# EAGLE design mk2 (EAGLE 7.2.0)
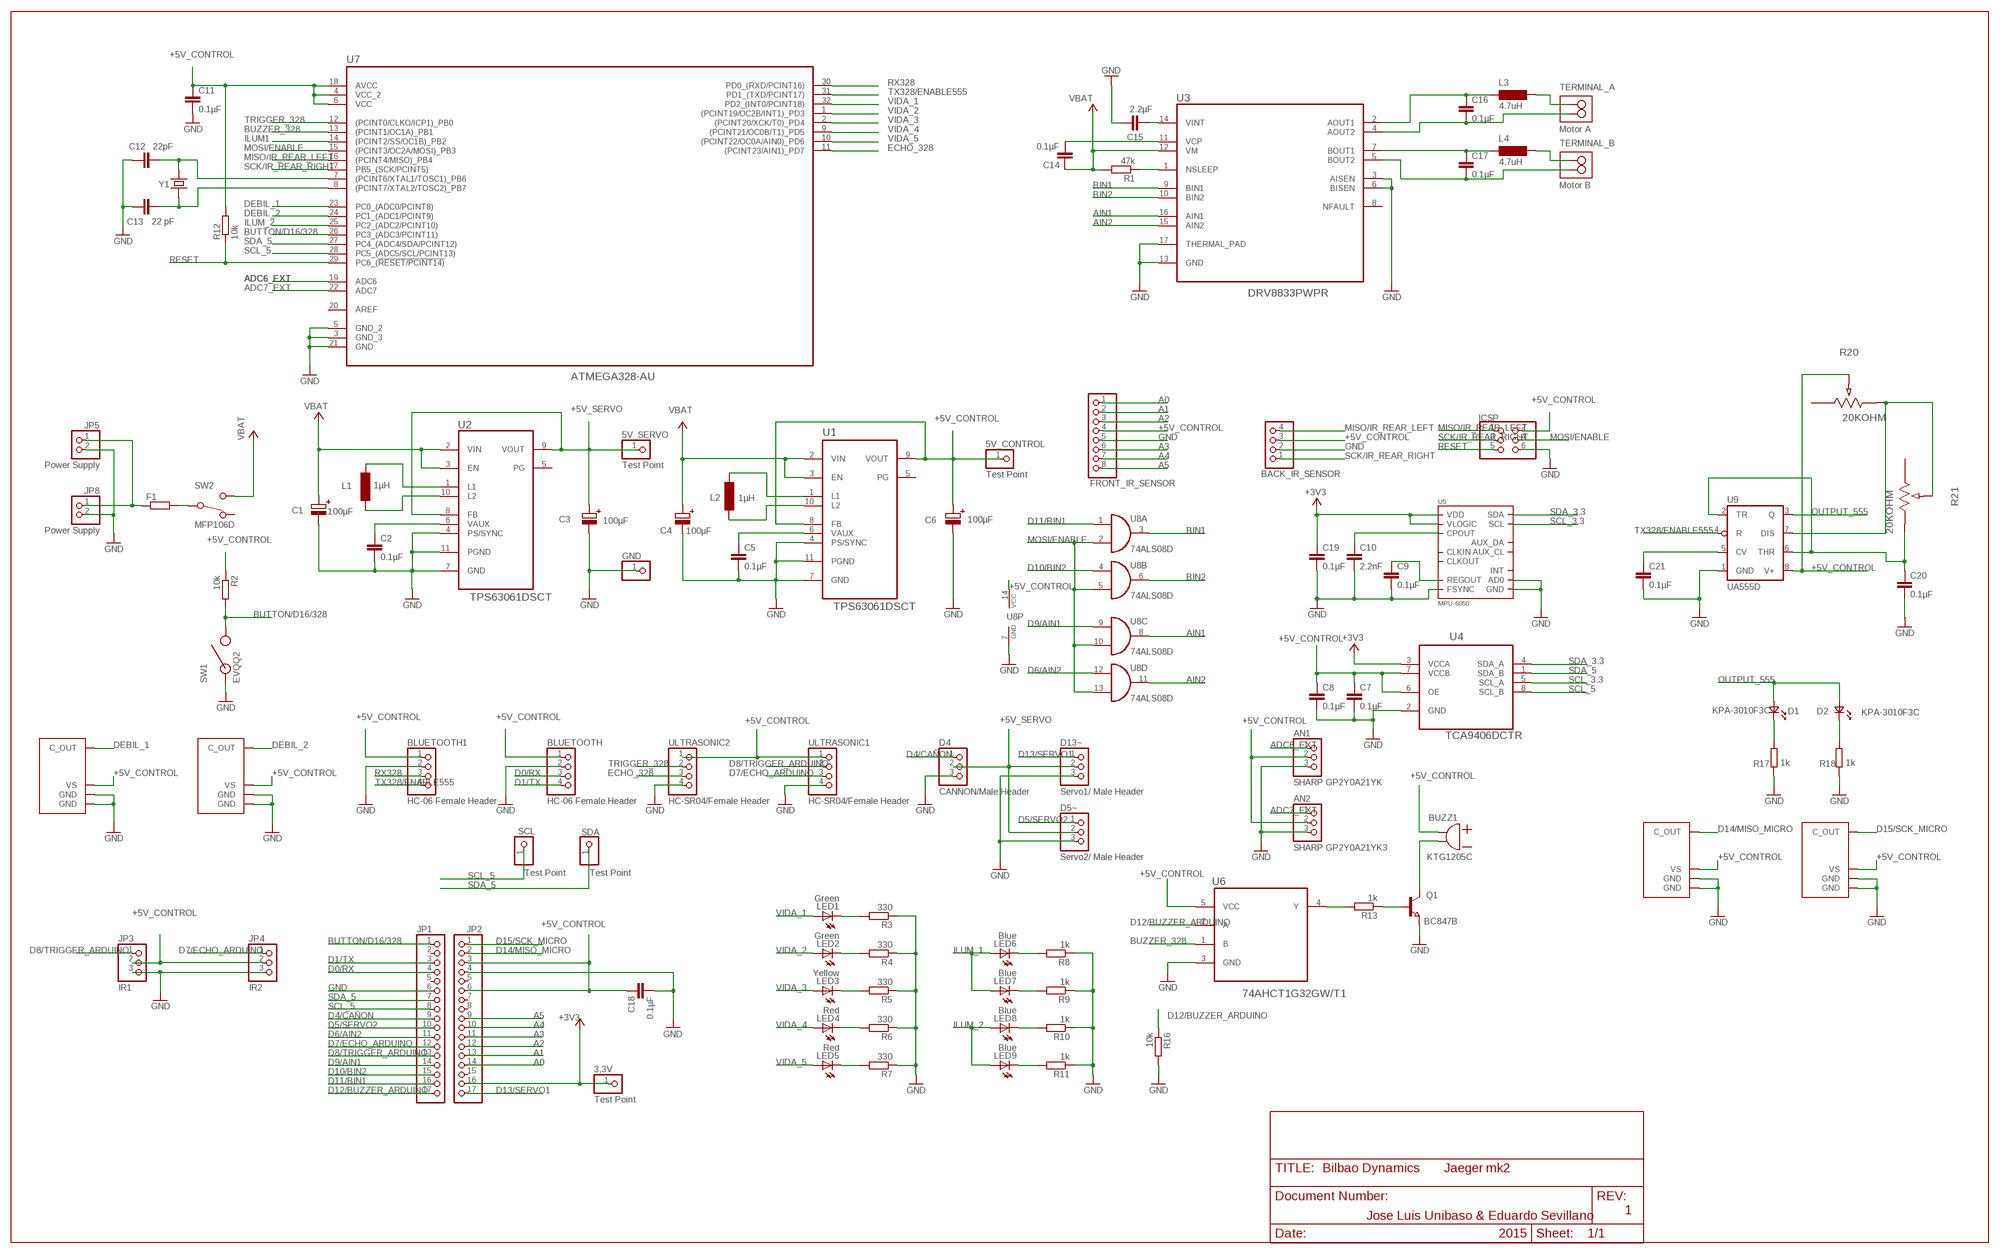
[diagram p0: schematic, sheet 1]

## Parts
3,3V  Test Point  PINHD-1X1  [1X01]
5V_CONTROL  Test Point  PINHD-1X1  [1X01]
5V_SERVO  Test Point  PINHD-1X1  [1X01]
AN1  SHARP GP2Y0A21YK  PINHD-1X3  [1X03]
AN2  SHARP GP2Y0A21YK3  PINHD-1X3  [1X03]
BACK_IR_SENSOR  PINHD-1X4  [1X04]
BLUETOOTH  HC-06 Female Header  PINHD-1X4  [1X04]
BLUETOOTH1  HC-06 Female Header  PINHD-1X4  [1X04]
BUZZ1  KTG1205C  [KTG1205C]
C1  100µF  EDK107M016A9G  [EDK107M016A9G]
C2  0.1µF  C-EUC0805K  [C0805K]
C3  100µF  EDK107M016A9G  [EDK107M016A9G]
C4  100µF  EDK107M016A9G  [EDK107M016A9G]
C5  0.1µF  C-EUC0805K  [C0805K]
C6  100µF  EDK107M016A9G  [EDK107M016A9G]
C7  0.1µF  C-EUC0805  [C0805]
C8  0.1µF  C-EUC0805  [C0805]
C9  0.1µF  C-EUC0805  [C0805]
C10  2.2nF  C-EUC0805  [C0805]
C11  0.1µF  C-EUC0805K  [C0805K]
C12  22pF  C-EUC0805K  [C0805K]
C13  22 pF  C-EUC0805K  [C0805K]
C14  0.1µF  C-EUC0805  [C0805]
C15  2.2µF  C-EUC0805  [C0805]
C16  0.1µF  C-EUC0805  [C0805]
C17  0.1µF  C-EUC0805  [C0805]
C18  0.1µF  C-EUC0805  [C0805]
C19  0.1µF  C-EUC0805  [C0805]
C20  0.1µF  C-EUC0805  [C0805]
C21  0.1µF  C-EUC0805  [C0805]
D1  KPA-3010F3C  [KPA-3010F3C]
D2  KPA-3010F3C  [KPA-3010F3C]
D4  CANNON/Male Header  PINHD-1X3  [1X03]
D5~  Servo2/ Male Header  PINHD-1X3  [1X03]
D13~  Servo1/ Male Header  PINHD-1X3  [1X03]
F1  R-EU_R1206  [R1206]
FRONT_IR_SENSOR  PINHD-1X8  [1X08]
GND  PINHD-1X1  [1X01]
ICSP  PINHD-2X3  [2X03]
IR_REC1  TSMP77000TR  [TSMP77000TR]
IR_REC2  TSMP77000TR  [TSMP77000TR]
IR_REC3  TSMP77000TR  [TSMP77000TR]
IR_REC4  TSMP77000TR  [TSMP77000TR]
JP1  PINHD-1X17  [1X17]
JP2  PINHD-1X17  [1X17]
JP3  IR1  PINHD-1X3  [1X03]
JP4  IR2  PINHD-1X3  [1X03]
JP5  Power Supply  PINHD-1X2  [1X02]
JP8  Power Supply  PINHD-1X2  [1X02]
L1  1µH  MCSDRH73B  [MCSDRH73B]
L2  1µH  MCSDRH73B  [MCSDRH73B]
L3  4.7uH  SRN4012T-4R7M  [SRN4012T-4R7M]
L4  4.7uH  SRN4012T-4R7M  [SRN4012T-4R7M]
LED1  Green  LEDSML0805  [SML0805]
LED2  Green  LEDSML0805  [SML0805]
LED3  Yellow  LEDSML0805  [SML0805]
LED4  Red  LEDSML0805  [SML0805]
LED5  Red  LEDSML0805  [SML0805]
LED6  Blue  LEDSML0805  [SML0805]
LED7  Blue  LEDSML0805  [SML0805]
LED8  Blue  LEDSML0805  [SML0805]
LED9  Blue  LEDSML0805  [SML0805]
Q1  BC847B  NPN-TRANSISTOR_SOT23  [SOT23]
R1  47k  R-EU_R0805  [R0805]
R2  10k  R-EU_R0805  [R0805]
R3  330  R-EU_R0805  [R0805]
R4  330  R-EU_R0805  [R0805]
R5  330  R-EU_R0805  [R0805]
R6  330  R-EU_R0805  [R0805]
R7  330  R-EU_R0805  [R0805]
R8  1k  R-EU_R0805  [R0805]
R9  1k  R-EU_R0805  [R0805]
R10  1k  R-EU_R0805  [R0805]
R11  1k  R-EU_R0805  [R0805]
R12  10k  R-EU_R0805  [R0805]
R13  1k  R-EU_R0805  [R0805]
R16  10k  R-EU_R0805  [R0805]
R17  1k  R-EU_R0805  [R0805]
R18  1k  R-EU_R0805  [R0805]
R20  20KOHM  EVM2NSX80B24-2N  [POT_EVM2N]
R21  20KOHM  EVM2NSX80B24-2N  [POT_EVM2N]
SCL  Test Point  PINHD-1X1  [1X01]
SDA  Test Point  PINHD-1X1  [1X01]
SW1  EVQQ2  [EVQQ2]
SW2  MFP106D  [MFP106D]
TERMINAL_A  Motor A  CTB30512BK  [CTB30512BK]
TERMINAL_B  Motor B  CTB30512BK  [CTB30512BK]
U1  TPS63061DSCT  [SON50P300X300X80-11N]
U2  TPS63061DSCT  [SON50P300X300X80-11N]
U3  DRV8833PWPR  [SOP65P640X120-17N]
U4  TCA9406DCTR  [SOP65P400X130-8N]
U5  MPU-6050  [QFN.24.4X4]
U6  74AHCT1G32GW/T1  [SOT65P210X110-5N]
U7  ATMEGA328-AU  [QFP80P900X900X120-32N]
U8  74ALS08D  [SO14]
U9  UA555D  [SO08]
ULTRASONIC1  HC-SR04/Female Header  PINHD-1X4  [1X04]
ULTRASONIC2  HC-SR04/Female Header  PINHD-1X4  [1X04]
Y1  E3SB16.0000F09G11AE  [E3SB16.0000F09G11A]

## Nets
+3V3: 3,3V.1 JP2.16 U4.3(VCCA)
+5V_CONTROL: 5V_CONTROL.1 AN1.2 AN2.2 BACK_IR_SENSOR.3 BLUETOOTH1.1 BLUETOOTH.1 BUZZ1.+ C6.1 C7.1 C8.1 C11.1 C18.1 FRONT_IR_SENSOR.4 ICSP.2 IR_REC1.2(VS) IR_REC2.2(VS) IR_REC3.2(VS) IR_REC4.2(VS) JP2.3 JP2.6 JP3.2 JP4.2 R2.1 R12.2 R20.2 U1.8(FB) U1.9(VOUT) U4.6(OE) U4.7(VCCB) U6.5(VCC) U7.4(VCC_2) U7.6(VCC) U7.18(AVCC) U8.14(P:VCC) U9.8(V+) ULTRASONIC1.1 ULTRASONIC2.1
+5V_SERVO: 5V_SERVO.1 C3.1 D4.2 D5~.2 D13~.2 U2.8(FB) U2.9(VOUT)
A0: FRONT_IR_SENSOR.1 JP2.14
A1: FRONT_IR_SENSOR.2 JP2.13
A2: FRONT_IR_SENSOR.3 JP2.12
A3: FRONT_IR_SENSOR.6 JP2.11
A4: FRONT_IR_SENSOR.7 JP2.10
A5: FRONT_IR_SENSOR.8 JP2.9
ADC6_EXT: AN1.1 U7.19(ADC6)
ADC7_EXT: AN2.1 U7.22(ADC7)
AIN1: U3.16(AIN1) U8.8(C:O)
AIN2: U3.15(AIN2) U8.11(D:O)
AM1: L3.P$2 TERMINAL_A.1
BIN1: U3.9(BIN1) U8.3(A:O)
BIN2: U3.10(BIN2) U8.6(B:O)
BM1: L4.P$2 TERMINAL_B.1
BUTTON/D16/328: JP1.1 R2.2 SW1.P$1 SW1.P$4 U7.26(PC3_(ADC3/PCINT11))
BUZZER_328: U6.1(B) U7.13((PCINT1/OC1A)_PB1)
C14: C13.2 U7.8((PCINT7/XTAL2/TOSC2)_PB7) Y1.1
D0/RX: BLUETOOTH.3 JP1.4
D1/TX: BLUETOOTH.4 JP1.3
D2: D2.C R18.1
D4/CAÑON: D4.1 JP1.9
D5/SERVO2: D5~.1 JP1.10
D6/AIN2: JP1.11 U8.12(D:I0)
D7/ECHO_ARDUINO: JP1.12 JP4.1 ULTRASONIC1.3
D8/TRIGGER_ARDUINO: JP1.13 JP3.1 ULTRASONIC1.2
D9/AIN1: JP1.14 U8.9(C:I0)
D10/BIN2: JP1.15 U8.4(B:I0)
D11/BIN1: JP1.16 U8.1(A:I0)
D12/BUZZER_ARDUINO: JP1.17 R16.1 U6.2(A)
D13/SERVO1: D13~.1 JP2.17
D14/MISO_MICRO: IR_REC1.3(C_OUT) JP2.2
D15/SCK_MICRO: IR_REC2.3(C_OUT) JP2.1
DEBIL_1: IR_REC3.3(C_OUT) U7.23(PC0_(ADC0/PCINT8))
DEBIL_2: IR_REC4.3(C_OUT) U7.24(PC1_(ADC1/PCINT9))
ECHO_328: U7.11((PCINT23/AIN1)_PD7) ULTRASONIC2.3
GND: AN1.3 AN2.3 BACK_IR_SENSOR.2 BLUETOOTH1.2 BLUETOOTH.2 C1.2 C2.2 C3.2 C4.2 C5.2 C6.2 C7.2 C8.2 C9.2 C10.2 C11.2 C12.1 C13.1 C15.1 C18.2 C19.2 C20.2 C21.2 D4.3 D5~.3 D13~.3 FRONT_IR_SENSOR.5 GND.1 ICSP.6 IR_REC1.1(GND) IR_REC1.4(GND) IR_REC2.1(GND) IR_REC2.4(GND) IR_REC3.1(GND) IR_REC3.4(GND) IR_REC4.1(GND) IR_REC4.4(GND) JP1.6 JP2.4 JP3.3 JP4.3 JP5.2 JP8.2 Q1.2(E) R3.1 R4.1 R5.1 R6.1 R7.1 R8.1 R9.1 R10.1 R11.1 R16.2 R17.2 R18.2 SW1.P$2 SW1.P$3 U1.4(PS/SYNC) U1.7(GND) U1.11(PGND) U2.4(PS/SYNC) U2.7(GND) U2.11(PGND) U3.3(AISEN) U3.6(BISEN) U3.13(GND) U3.17(THERMAL_PAD) U4.2(GND) U5.9(AD0) U5.11(FSYNC) U5.18(GND) U6.3(GND) U7.3(GND_3) U7.5(GND_2) U7.21(GND) U8.7(P:GND) U9.1(GND) ULTRASONIC1.4 ULTRASONIC2.4
ILUM1: U7.14((PCINT2/SS/OC1B)_PB2)
ILUM_1: LED6.A LED7.A
ILUM_2: LED8.A LED9.A U7.25(PC2_(ADC2/PCINT10))
LED4: LED4.C R6.2
MISO/IR_REAR_LEFT: BACK_IR_SENSOR.4 ICSP.1 U7.16((PCINT4/MISO)_PB4)
MOSI/ENABLE: ICSP.4 U7.15((PCINT3/OC2A/MOSI)_PB3) U8.2(A:I1) U8.5(B:I1) U8.10(C:I1) U8.13(D:I1)
N$1: C16.1 L3.P$1 U3.2(AOUT1)
N$2: C16.2 TERMINAL_A.2 U3.4(AOUT2)
N$3: C17.1 L4.P$1 U3.7(BOUT1)
N$4: C17.2 TERMINAL_B.2 U3.5(BOUT2)
N$5: C19.1 U5.8(VLOGIC) U5.13(VDD)
N$6: F1.1 JP5.1 JP8.1
N$7: R1.1 U3.1(NSLEEP)
N$9: C14.2 U3.11(VCP)
N$10: L2.2 U1.1(L1)
N$11: C2.1 U2.6(VAUX)
N$12: L2.1 U1.10(L2)
N$13: R13.2 U6.4(Y)
N$14: Q1.1(B) R13.1
N$15: L1.2 U2.1(L1)
N$16: L1.1 U2.10(L2)
N$17: BUZZ1.- Q1.3(C)
N$18: C5.1 U1.6(VAUX)
N$19: LED1.C R3.2
N$20: LED2.C R4.2
N$21: LED3.C R5.2
N$22: LED8.C R10.2
N$23: D1.C R17.1
N$24: LED5.C R7.2
N$27: C15.2 U3.14(VINT)
N$28: C12.2 U7.7((PCINT6/XTAL1/TOSC1)_PB6) Y1.2
N$31: C20.1 R21.3 U9.2(TR) U9.6(THR)
N$32: LED6.C R8.2
N$33: LED7.C R9.2
N$34: LED9.C R11.2
N$35: C10.1 U5.20(CPOUT)
N$36: C9.1 U5.10(REGOUT)
N$39: R20.3 R21.2 U9.7(DIS)
N$41: F1.2 SW2.COM
N$42: C21.1 U9.5(CV)
OUTPUT_555: D1.A D2.A U9.3(Q)
RESET: ICSP.5 R12.1 U7.29(PC6_(!RESET/PCINT14))
RX328: BLUETOOTH1.3 U7.30(PD0_(RXD/PCINT16))
SCK/IR_REAR_RIGHT: BACK_IR_SENSOR.1 ICSP.3 U7.17(PB5_(SCK/PCINT5))
SCL_3.3: U4.5(SCL_A) U5.23(SCL)
SCL_5: JP1.8 SCL.1 U4.8(SCL_B) U7.28(PC5_(ADC5/SCL/PCINT13))
SDA_3.3: U4.4(SDA_A) U5.24(SDA)
SDA_5: JP1.7 SDA.1 U4.1(SDA_B) U7.27(PC4_(ADC4/SDA/PCINT12))
TRIGGER_328: U7.12((PCINT0/CLKO/ICP1)_PB0) ULTRASONIC2.2
TX328/ENABLE555: BLUETOOTH1.4 U7.31(PD1_(TXD/PCINT17)) U9.4(R)
VBAT: C1.1 C4.1 C14.1 R1.2 SW2.2 U1.2(VIN) U1.3(EN) U2.2(VIN) U2.3(EN) U3.12(VM)
VIDA_1: LED1.A U7.32(PD2_(INT0/PCINT18))
VIDA_2: LED2.A U7.1((PCINT19/OC2B/INT1)_PD3)
VIDA_3: LED3.A U7.2((PCINT20/XCK/T0)_PD4)
VIDA_4: LED4.A U7.9((PCINT21/OC0B/T1)_PD5)
VIDA_5: LED5.A U7.10((PCINT22/OC0A/AIN0)_PD6)
Unconnected: JP1.2 JP1.5 JP2.5 JP2.7 JP2.8 JP2.15 R20.1 R21.1 SW2.1 U1.5(PG) U2.5(PG) U3.8(NFAULT) U5.1(CLKIN) U5.6(AUX_DA) U5.7(AUX_CL) U5.12(INT) U5.22(CLKOUT) U7.20(AREF)

## Notes on the sheet
- Bilbao Dynamics | Jaeger
- 1
- Jose Luis Unibaso & Eduardo Sevillano
- 2015

## Library data of the parts
3,3V 5V_CONTROL 5V_SERVO GND SCL SDA = pinhead:PINHD-1X1: PIN HEADER
AN1 AN2 D4 D5~ D13~ JP3 JP4 = pinhead:PINHD-1X3: PIN HEADER
BACK_IR_SENSOR BLUETOOTH BLUETOOTH1 ULTRASONIC1 ULTRASONIC2 = pinhead:PINHD-1X4: PIN HEADER
BUZZ1 = Jaegger_MKII:KTG1205C
C1 C3 C4 C6 = Jaegger_MKII:EDK107M016A9G
C2 C5 C7-C21 = rcl:C-EU: CAPACITOR, European symbol
D1 D2 = Jaegger_MKII:KPA-3010F3C
F1 R1-R11 R13 R16-R18 = rcl:R-EU_: RESISTOR, European symbol
FRONT_IR_SENSOR = pinhead:PINHD-1X8: PIN HEADER
ICSP = pinhead:PINHD-2X3: PIN HEADER
IR_REC1-IR_REC4 = Jaegger_MKII:TSMP77000TR
JP1 JP2 = pinhead:PINHD-1X17: PIN HEADER
JP5 JP8 = pinhead:PINHD-1X2: PIN HEADER
L1 L2 = Jaegger_MKII:MCSDRH73B
L3 L4 = Jaegger_MKII:SRN4012T-4R7M
LED1-LED9 = led:LED: LED OSRAM: - CHIPLED LG R971, LG N971, LY N971, LG Q971, LY Q971, LO R971, LY R971 LH N974, LH R974 LS Q976, LO Q976, LY Q976 LO Q996 - Hyper CHIPLED LW Q18S LB Q993, LB Q99A, LB R99A - SideLED LS A670, LO A670, LY A670, LG A670, LP A670 LB A673, LV A673, LT A673, LW A673 LH A674 LY A675 LS A676, LA A676, LO A676, LY A676, LW A676 LS A679, LY A679, LG A679 - Hyper Micro SIDELED® LS Y876, LA Y876, LO Y876, LY Y876 LT Y87S - SmartLED LW L88C, LW L88S LB L89C, LB L89S, LG L890 LS L89K, LO L89K, LY L89K LS L896, LA L896, LO L896, LY L896 - TOPLED LS T670, LO T670, LY T670, LG T670, LP T670 LSG T670, LSP T670, LSY T670, LOP T670, LYG T670 LG T671, LOG T671, LSG T671 LB T673, LV T673, LT T673, LW T673 LH T674 LS T676, LA T676, LO T676, LY T676, LB T676, LH T676, LSB T676, LW T676 LB T67C, LV T67C, LT T67C, LS T67K, LO T67K, LY T67K, LW E67C LS E67B, LA E67B, LO E67B, LY E67B, LB E67C, LV E67C, LT E67C LW T67C LS T679, LY T679, LG T679 LS T770, LO T770, LY T770, LG T770, LP T770 LB T773, LV T773, LT T773, LW T773 LH T774 LS E675, LA E675, LY E675, LS T675 LS T776, LA T776, LO T776, LY T776, LB T776 LHGB T686 LT T68C, LB T68C - Hyper Mini TOPLED® LB M676 - Mini TOPLED Santana® LG M470 LS M47K, LO M47K, LY M47K Source: http://www.osram.convergy.de LUXEON: - LUMILED® LXK2-PW12-R00, LXK2-PW12-S00, LXK2-PW14-U00, LXK2-PW14-V00 LXK2-PM12-R00, LXK2-PM12-S00, LXK2-PM14-U00 LXK2-PE12-Q00, LXK2-PE12-R00, LXK2-PE12-S00, LXK2-PE14-T00, LXK2-PE14-U00 LXK2-PB12-K00, LXK2-PB12-L00, LXK2-PB12-M00, LXK2-PB14-N00, LXK2-PB14-P00, LXK2-PB14-Q00 LXK2-PR12-L00, LXK2-PR12-M00, LXK2-PR14-Q00, LXK2-PR14-R00 LXK2-PD12-Q00, LXK2-PD12-R00, LXK2-PD12-S00 LXK2-PH12-R00, LXK2-PH12-S00 LXK2-PL12-P00, LXK2-PL12-Q00, LXK2-PL12-R00 Source: www.luxeon.com KINGBRIGHT: KA-3528ASYC Source: www.kingbright.com
Q1 = semicon-smd-ipc:NPN-TRANSISTOR_: NPN TRANSISTOR
R12 = resistor:R-EU_: RESISTOR, European symbol
R20 R21 = Panasonic-Trimmer_Potentiometers:EVM: Potentiometers; MPN: EVM2NSX80B24; OC_FARNELL: 1849759; OC_NEWARK: 17T5161; PACKAGE: EVM2N; POWERRATING: 0.15W; SUPPLIER: PANASONIC; TOLERANCE: ±25 %
SW1 = Jaegger_MKII:EVQQ2
SW2 = Jaegger_MKII:MFP106D
TERMINAL_A TERMINAL_B = Jaegger_MKII:CTB30512BK
U1 U2 = Jaegger_MKII:TPS63061DSCT: VOLTAGE BUCK-BOOST CONVERTER,SON- 10; MPN: TPS63061DSCT; OC_FARNELL: 2078527; OC_NEWARK: 82T9734; PACKAGE: SON- 10; SUPPLIER: TEXAS INSTRUMENTS
U3 = Jaegger_MKII:DRV8833PWPR: DUAL H-BRIDGE MOTOR DRIVER,HTSSOP -16; MPN: DRV8833PWPR; OC_FARNELL: 2057085; OC_NEWARK: 64T2941; PACKAGE: HTSSOP -16; SUPPLIER: TEXAS INSTRUMENTS
U4 = TCA9406DCTR:TCA9406DCTR: 2-BIT BIDIRECTIONAL 1MHz, I2C BUS AND SMBUS VOLTAGE-LEVEL TRANSLATOR WITH 8kV HBM ESD,SM8-8; MPN: TCA9406DCTR; OC_FARNELL: 1972384; OC_NEWARK: 86W6768; PACKAGE: SM8-8; SUPPLIER: TEXAS INSTRUMENTS
U5 = invensense:MPU-6050
U6 = Jaegger_MKII:74AHCT1G32GW/T1: 2-input OR gate; MPN: 74AHCT1G32GW/T1; OC_FARNELL: 1085248; OC_NEWARK: 99K0512; PACKAGE: SOT353-1-5; SUPPLIER: NXP
U7 = atmel:ATMEGA328-AU: MCU, 8BIT, AVR, 32K FLASH, TQFP-32; MPN: ATMEGA328-AU; OC_FARNELL: 1972086; OC_NEWARK: 68T2926; PACKAGE: TQFP-32; SUPPLIER: ATMEL
U8 = 74xx-eu:74*08: Quad 2-input AND gate
U9 = linear:*555: TIMER
Y1 = Jaegger_MKII:E3SB16.0000F09G11AE

## Board
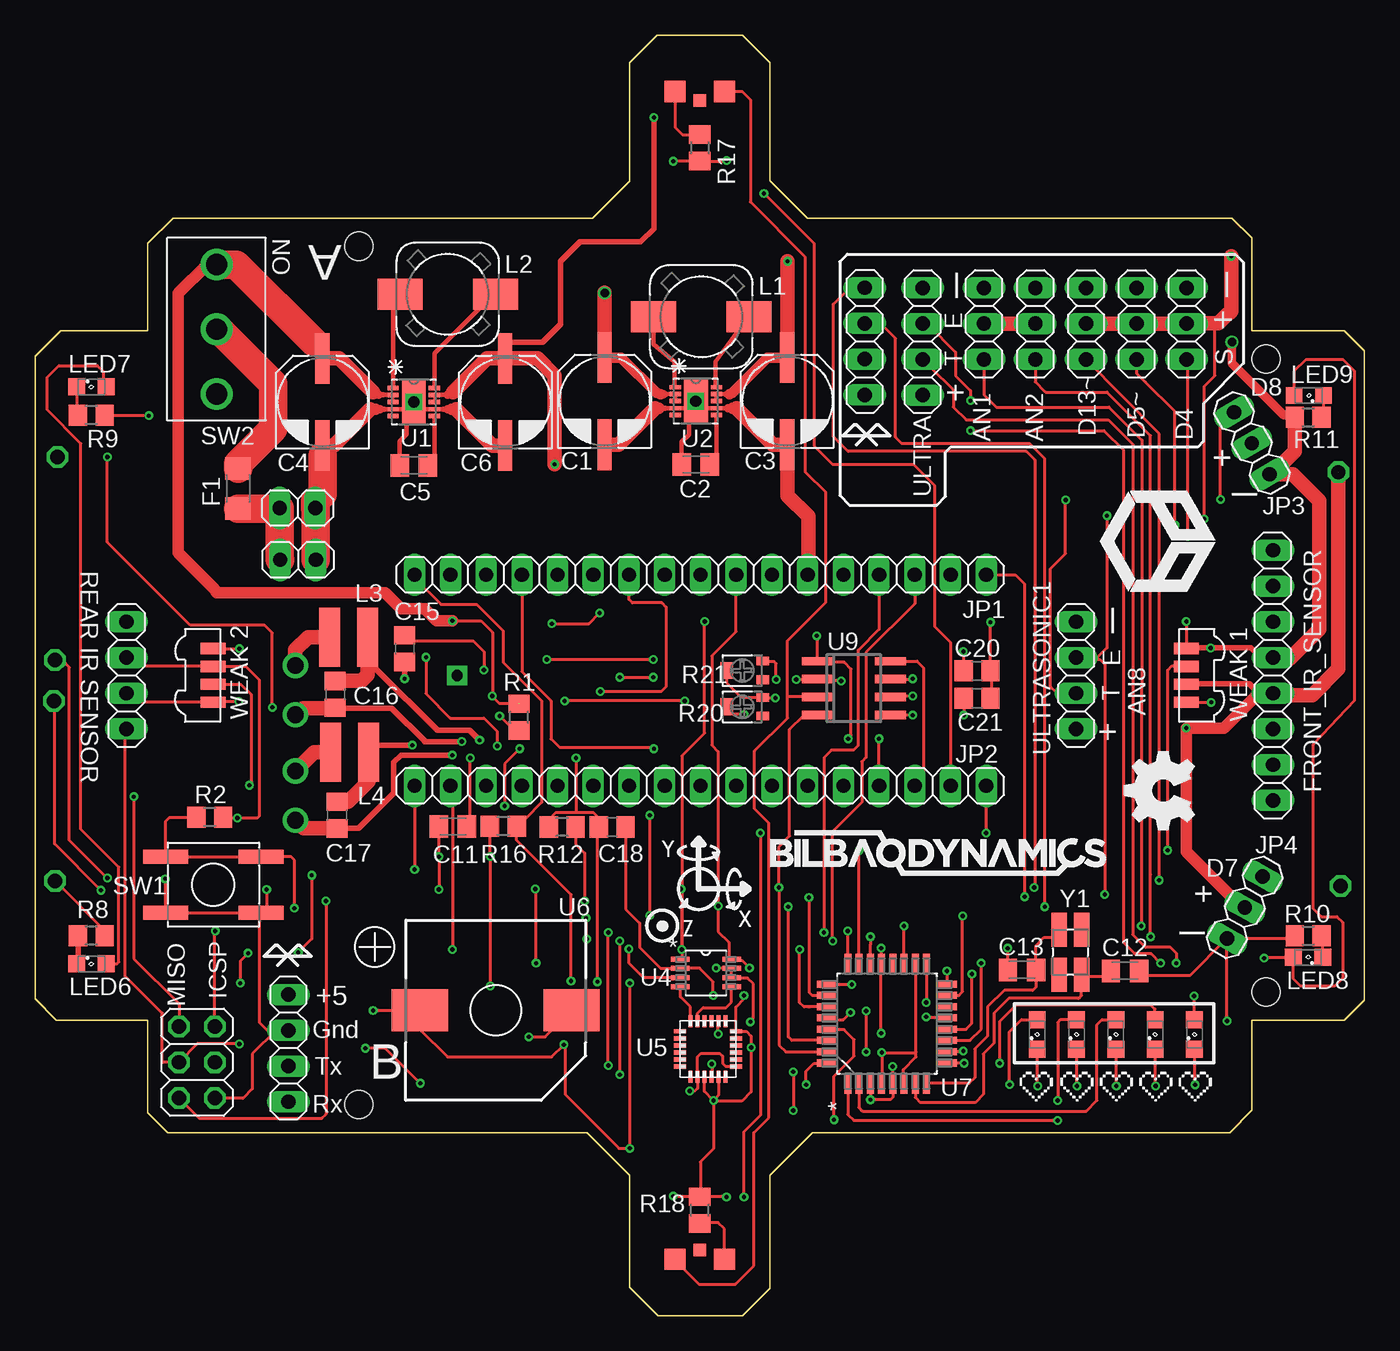
[diagram p1: board, top side]
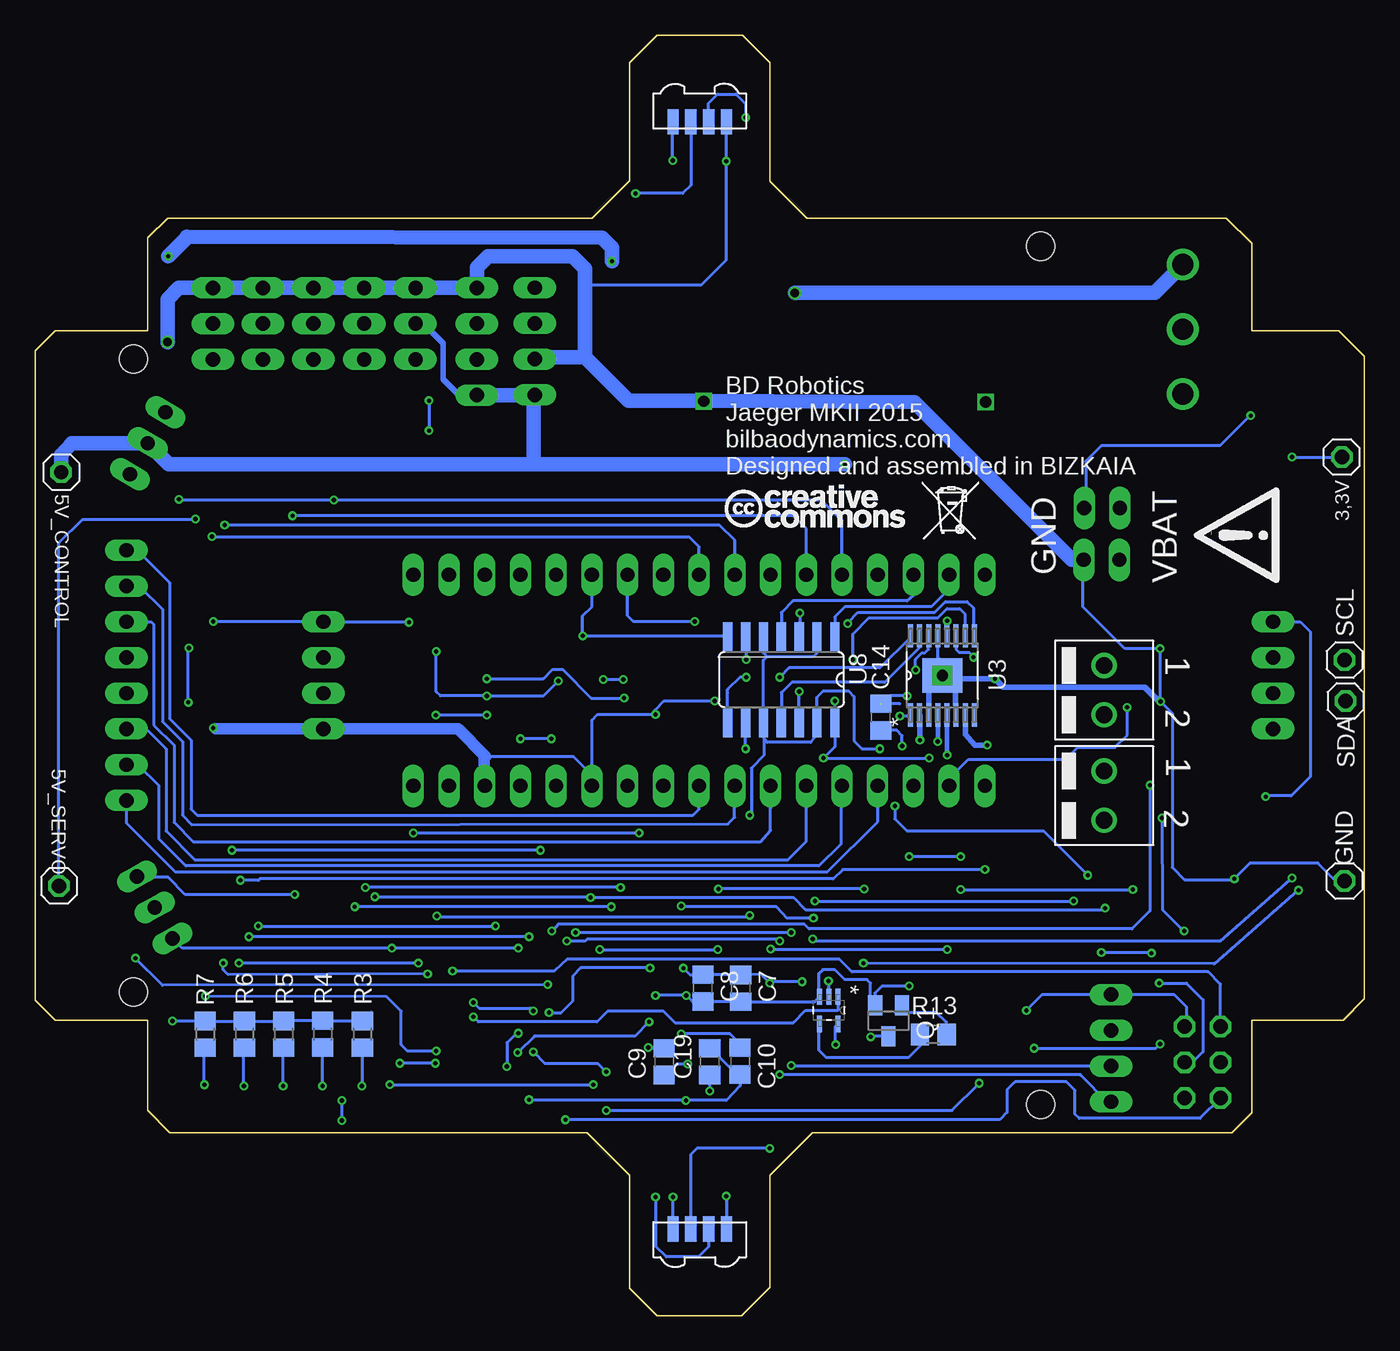
[diagram p2: board, bottom side, seen from below]

Size 94.5 x 91 mm. Coordinates in mm from the lower left corner, seen from the top.
Outline: 52.25,1.95 52.25,9.99 55.26,13 84.92,13 86.5,14.58 86.5,21 93.09,21 94.5,22.41 94.5,68.59 93.09,70 86.5,70 86.5,76.59 85.09,78 54.91,78 52.25,80.66 52.25,89.05 50.3,91 44.2,91 42.25,89.05 42.25,80.61 39.64,78 9.8,78 8,76.2 8,70 1.8,70 0,68.2 0,22.5 1.5,21 8,21 8,14.41 9.41,13 39.24,13 42.25,9.99 42.25,2.02 44.27,0 50.3,0 52.25,1.95
Copper layers (1*16): Top 0.035mm / dielectric 1.5mm / Bottom 0.035mm
Design rules "EagleRules": minimum track width 7mil, minimum drill 12mil, track to track 7mil, track to pad 7mil, pad to pad 7mil, via to via 7mil, smd to smd 0mil, copper to edge 20mil, drill to drill 10mil, minimum pad ring 10mil, minimum via ring 6mil, stop-mask expansion 2mil, vias tented up to drill 25mil, thermal gap 10mil
Holes 2 mm at 23,15 23,76 87.5,23 87.5,68

### Footprints (pad centres in the part's own frame; a part is rotated, then mirrored left to right if it is on the bottom)
1X01 = drill 1.016 octagon: 1 0,0
1X03 = drill 1.016 long: 1 -2.54,0; 2 0,0; 3 2.54,0
1X04 = drill 1.016 long: 1 -3.81,0; 2 -1.27,0; 3 1.27,0; 4 3.81,0
KTG1205C = smd 4 x 3: + -5.4,0; - 5.4,0
EDK107M016A9G = smd 3.6 x 1: 1 3.1,0; 2 -3.1,0
C0805K = smd 1.3 x 1.6: 1 -1,0; 2 1,0
C0805 = smd 1.3 x 1.5: 1 -0.95,0; 2 0.95,0
KPA-3010F3C = smd 1.5 x 1.5: A -1.75,0; C 1.75,0 | smd 0.9 x 0.9: NC 0,0.65
R1206 = smd 1.6 x 1.803: 1 -1.422,0; 2 1.422,0
1X08 = drill 1.016 long: 1 -8.89,0; 2 -6.35,0; 3 -3.81,0; 4 -1.27,0; 5 1.27,0; 6 3.81,0; 7 6.35,0; 8 8.89,0
2X03 = drill 1.016 octagon: 1 -2.54,-1.27; 2 -2.54,1.27; 3 0,-1.27; 4 0,1.27; 5 2.54,-1.27; 6 2.54,1.27
TSMP77000TR = smd 0.8 x 1.8: 1 -1.905,0.65; 2 -0.635,0.65; 3 0.635,0.65; 4 1.905,0.65
1X17 = drill 1.016 long: 1 -20.32,0; 2 -17.78,0; 3 -15.24,0; 4 -12.7,0; 5 -10.16,0; 6 -7.62,0; 7 -5.08,0; 8 -2.54,0; 9 0,0; 10 2.54,0; 11 5.08,0; 12 7.62,0; 13 10.16,0; 14 12.7,0; 15 15.24,0; 16 17.78,0; 17 20.32,0
1X02 = drill 1.016 long: 1 -1.27,0; 2 1.27,0
MCSDRH73B = smd 3.2 x 2.2: 1 -3.4,0; 2 3.4,0
SRN4012T-4R7M = smd 1.5 x 4.2: P$1 -1.35,0; P$2 1.35,0
SML0805 = smd 1.2 x 1.2: A 1.05,0; C -1.05,0
SOT23 = smd 1 x 1.4: 1 -0.95,-1.1; 2 0.95,-1.1; 3 0,1.1
R0805 = smd 1.3 x 1.5: 1 -0.95,0; 2 0.95,0
POT_EVM2N = smd 0.61 x 0.889: 1 -0.66,-1.448; 3 0.66,-1.448 | smd 1.194 x 0.889: 2 0,1.092
EVQQ2 = smd 3.2 x 1: P$1 -3.4,2; P$2 -3.4,-2; P$3 3.4,-2; P$4 3.4,2
MFP106D = drill 1.5: 1 -4.6,0; 2 4.6,0; COM 0,0
CTB30512BK = drill 1.2: 1 -1.7,0; 2 1.8,0
SON50P300X300X80-11N = smd 0.813 x 0.305: 1 -1.473,0.991; 2 -1.473,0.508; 3 -1.473,0; 4 -1.473,-0.508; 5 -1.473,-0.991; 6 1.473,-0.991; 7 1.473,-0.508; 8 1.473,0; 9 1.473,0.508; 10 1.473,0.991 | smd 1.702 x 3.15: 11 0,0
SOP65P640X120-17N = smd 1.651 x 0.356: 1 -2.819,2.286; 2 -2.819,1.626; 3 -2.819,0.965; 4 -2.819,0.33; 5 -2.819,-0.33; 6 -2.819,-0.965; 7 -2.819,-1.626; 8 -2.819,-2.286; 9 2.819,-2.286; 10 2.819,-1.626; 11 2.819,-0.965; 12 2.819,-0.33; 13 2.819,0.33; 14 2.819,0.965; 15 2.819,1.626; 16 2.819,2.286 | smd 2.464 x 2.819: 17 0,0
SOP65P400X130-8N = smd 1.321 x 0.356: 1 -1.829,0.965; 2 -1.829,0.33; 3 -1.829,-0.33; 4 -1.829,-0.965; 5 1.829,-0.965; 6 1.829,-0.33; 7 1.829,0.33; 8 1.829,0.965
QFN.24.4X4 = smd 0.85 x 0.3: 1 -1.975,1.25; 2 -1.975,0.75; 3 -1.975,0.25; 4 -1.975,-0.25; 5 -1.975,-0.75; 6 -1.975,-1.25; 13 1.975,-1.25; 15 1.975,-0.25; 16 1.975,0.25; 17 1.975,0.75; 18 1.975,1.25; 25 1.975,-0.75 | smd 0.3 x 0.85: 7 -1.25,-1.975; 8 -0.75,-1.975; 9 -0.25,-1.975; 10 0.25,-1.975; 11 0.75,-1.975; 12 1.25,-1.975; 19 1.25,1.975; 20 0.75,1.975; 21 0.25,1.975; 22 -0.25,1.975; 23 -0.75,1.975; 24 -1.25,1.975
SOT65P210X110-5N = smd 1.168 x 0.356: 1 -0.965,0.66; 2 -0.965,0; 3 -0.965,-0.66; 4 0.965,-0.66; 5 0.965,0.66
QFP80P900X900X120-32N = smd 1.473 x 0.508: 1 -4.242,2.794; 2 -4.242,2.007; 3 -4.242,1.194; 4 -4.242,0.406; 5 -4.242,-0.406; 6 -4.242,-1.194; 7 -4.242,-2.007; 8 -4.242,-2.794; 17 4.242,-2.794; 18 4.242,-2.007; 19 4.242,-1.194; 20 4.242,-0.406; 21 4.242,0.406; 22 4.242,1.194; 23 4.242,2.007; 24 4.242,2.794 | smd 0.508 x 1.473: 9 -2.794,-4.242; 10 -2.007,-4.242; 11 -1.194,-4.242; 12 -0.406,-4.242; 13 0.406,-4.242; 14 1.194,-4.242; 15 2.007,-4.242; 16 2.794,-4.242; 25 2.794,4.242; 26 2.007,4.242; 27 1.194,4.242; 28 0.406,4.242; 29 -0.406,4.242; 30 -1.194,4.242; 31 -2.007,4.242; 32 -2.794,4.242
SO14 = smd 0.66 x 2.032: 1 -3.81,-3.073; 2 -2.54,-3.073; 3 -1.27,-3.073; 4 0,-3.073; 5 1.27,-3.073; 6 2.54,-3.073; 7 3.81,-3.073; 8 3.81,3.073; 9 2.54,3.073; 10 1.27,3.073; 11 0,3.073; 12 -1.27,3.073; 13 -2.54,3.073; 14 -3.81,3.073
SO08 = smd 0.6 x 2.2: 1 -1.905,-2.6; 2 -0.635,-2.6; 3 0.635,-2.6; 4 1.905,-2.6; 5 1.905,2.6; 6 0.635,2.6; 7 -0.635,2.6; 8 -1.905,2.6
E3SB16.0000F09G11A = smd 2.4 x 1.1: 1 -1.6,-0.8; 2 1.6,0.8; SUJ1 -1.6,0.8; SUJ2 1.6,-0.8

### Placement (x,y rotation side)
3,3V  1.6,61.02 180 bottom
5V_CONTROL  92.65,59.94 0 bottom
5V_SERVO  92.81,30.54 0 bottom
AN1  67.46,70.5 90 top
AN2  71.11,70.5 90 top
BACK_IR_SENSOR  6.5,45.5 90 top
BLUETOOTH  18,19 270 top
BLUETOOTH1  58.98,69.25 90 top
BUZZ1  32.74,21.7 0 top
C1  40.47,64.99 90 top
C2  46.97,60.49 180 top
C3  53.47,64.99 90 top
C4  20.42,64.93 90 top
C5  26.92,60.43 180 top
C6  33.42,64.93 90 top
C7  44.34,23.26 270 bottom
C8  47.03,23.27 270 bottom
C9  49.78,18.06 90 bottom
C10  44.38,18.08 270 bottom
C11  29.7,34.76 180 top
C12  77.48,24.5 180 top
C13  70.16,24.57 0 top
C14  34.38,42.53 270 bottom
C15  26.27,47.4 90 top
C16  21.34,44.15 270 top
C17  21.47,35.57 270 top
C18  41.03,34.73 0 top
C19  46.54,18.05 90 bottom
C20  66.97,45.82 0 top
C21  66.96,43.88 0 top
D1  47.25,87 180 top
D2  47.25,4 0 top
D4  81.86,70.5 90 top
D5~  78.31,70.5 90 top
D13~  74.71,70.5 90 top
F1  14.43,58.78 90 top
FRONT_IR_SENSOR  88,45.5 90 top
GND  1.42,30.89 0 bottom
ICSP  11.5,18 270 top
IR_REC1  47.25,85.5 180 bottom
IR_REC2  47.25,5.5 0 bottom
IR_REC3  82.5,45.5 90 top
IR_REC4  12,45.5 270 top
JP1  47.3,52.65 180 top
JP2  47.3,37.65 180 top
JP3  86.5,62 300 top
JP4  86,29 240 top
JP5  18.65,57.39 0 top
JP8  18.68,53.71 0 top
L1  47.37,70.99 180 top
L2  29.33,72.59 180 top
L3  22.28,48.21 180 top
L4  22.35,40.04 180 top
LED1  71.24,19.98 90 top
LED2  74.03,19.98 90 top
LED3  76.83,19.98 90 top
LED4  79.62,19.98 90 top
LED5  82.41,19.98 90 top
LED6  4,25 0 top
LED7  4,66 0 top
LED8  90.5,25.46 180 top
LED9  90.55,65.39 180 top
Q1  33.83,20.96 180 bottom
R1  34.41,42.53 90 top
R2  12.41,35.43 180 top
R3  71.24,19.98 270 bottom
R4  74.07,20.01 270 bottom
R5  76.83,19.98 270 bottom
R6  79.62,19.98 270 bottom
R7  82.41,19.98 270 bottom
R8  4,27 180 top
R9  4,64 180 top
R10  90.5,27 0 top
R11  90.5,63.85 0 top
R12  37.47,34.72 180 top
R13  30.65,19.97 180 bottom
R16  33.28,34.79 180 top
R17  47.25,83 270 top
R18  47.25,7.5 90 top
R20  50.27,43.26 90 top
R21  50.27,45.85 90 top
SCL  1.41,46.59 0 bottom
SDA  1.33,43.68 0 bottom
SW1  12.67,30.62 0 top
SW2  12.9,70.1 90 top
TERMINAL_A  18.5,44.5 270 top
TERMINAL_B  18.5,37 270 top
U1  26.92,64.93 0 top
U2  46.97,64.99 0 top
U3  30,45.5 90 bottom
U4  47.69,24.35 0 top
U5  47.84,18.95 0 top
U6  38.07,21.7 270 bottom
U7  60.57,20.75 90 top
U8  41.45,45.2 180 bottom
U9  58.2,44.6 270 top
ULTRASONIC1  74,45.5 90 top
ULTRASONIC2  63.09,69.23 90 top
Y1  73.6,25.82 270 top

### Tracks (layer width: path | path; a pad name or v marks a point on that pad's centre or on a via)
+3V3  (via drill 0.3 pad 0.61)
  Top 0.203: JP2.16 29.52,36.32 29.67,36.17 v29.67,26.01 | U4.3 43.24,24.02 42.22,25.04 v42.22,26.06 | v16.87,43.23 16.87,48.51 16.31,49.07 11.02,49.07 5.13,54.97 v5.13,61.01
  Bottom 0.203: 29.62,26.01 v29.67,26.01 42.16,26.01 v42.22,26.06 | JP2.16 29.52,38.15 28.14,39.52 21.23,39.52 20.37,40.39 17.73,40.39 16.87,41.25 v16.87,43.23 | v5.13,61.01 3,3V.1
+5V_CONTROL  (via drill 0.3 pad 0.61)  (1 unrouted)
  Top 0.203: U1.9 U1.8 | U7.6 61.72,16.55 61.72,17.48 62.64,18.39 62.64,18.75 | 62.64,18.75 62.64,24.93 U7.18 | U9.8 62.69,46.51 63.14,46.05 63.14,37.34 62.85,37.34 JP2.3 | v50.39,42.72 49.62,42.72 R20.2 | v42.27,23.62 v42.27,11.89 | BACK_IR_SENSOR.3 7.13,46.13 IR_REC4.2 14.99,46.13 15.95,45.16 15.95,35.51 15.8,35.36 v14.38,35.36 13.43,35.36 R2.1 | v50.85,20.88 50.85,20.98 51.05,21.18 51.05,23.57 50.64,23.98 49.56,23.98 U4.6 U4.7 48.42,24.68 v48.41,24.69 | R12.2 36.52,35.25 37.03,35.76 38.51,35.76 | 39.78,35.03 C18.1 | U7.4 60.2,16.54 v60.2,18.69 62.59,18.69 62.64,18.75 | v46.18,43.69 v37.64,43.69 37.64,43.63 | v24.03,21.69 26.26,21.69 26.52,21.95 27.09,21.95 BUZZ1.+ 27.34,20.36 29.31,18.39 36.73,18.39 v37.59,19.25 37.69,19.15 37.69,15.7 41.5,11.89 v42.27,11.89 | 42.32,11.89 v42.27,11.89 | 44.15,84.99 v43.99,85.14 | ICSP.2 12.77,27.25 v12.8,27.33 | v38.46,39.62 38.46,35.81 38.51,35.76 | v30.94,39.62 30.94,35 C11.1 | 38.51,35.76 39.67,35.76 40.08,35.36 C18.1 | v39.98,23.72 39.98,34.63 C18.1
  Top 0.305: 29.32,65.43 28.4,65.43 U1.9
  Top 0.406: FRONT_IR_SENSOR.4 86.99,44.23 86.31,44.91 81.89,44.91 IR_REC3.2 | 33.43,69.19 36.08,69.19 37.34,70.45 37.34,74.92 38.73,76.3 43.05,76.3 43.99,77.25 v43.99,85.14
  Top 0.61: 29.72,65.63 29.52,65.63 29.32,65.43 | 33.43,69.19 33.38,69.14 33.38,68.08 C6.1
  Top 0.813: 86.99,44.23 84.51,41.76 v81.84,41.76 81.84,32.98 85.82,29 JP4.2
  Top 1.016: 29.72,65.63 32.12,68.03 C6.1 35.71,68.03 36.93,66.8 v36.93,60.5 | AN1.2 AN2.2 | 5V_CONTROL.1 92.65,45.96 90.78,44.09 88.14,44.09 FRONT_IR_SENSOR.4
  Bottom 0.203: IR_REC1.2 46.62,86.18 45.97,86.82 44.67,86.82 43.99,86.14 v43.99,85.14 | IR_REC2.2 47.88,11.45 47.45,11.89 v42.27,11.89 | 62.59,37.7 JP2.3 | JP2.6 54.92,38.41 | 54.92,38.41 56.24,39.73 62.48,39.73 62.59,39.62 | 54.92,38.41 54.92,42.31 54.51,42.72 50.44,42.72 | 50.44,42.72 v50.39,42.72 | 81.67,41.69 v81.84,41.76 | v39.98,23.72 42.16,23.72 v42.27,23.62 42.93,24.29 C7.1 C8.1 47.96,24.23 48.31,24.59 v48.41,24.69 | v50.85,20.88 50.88,20.83 51.84,19.86 58.98,19.86 58.95,19.86 59,19.86 v60.2,18.69 | ICSP.2 12.55,20.76 12.55,21.03 12.65,21.13 12.65,21.95 13.51,22.81 BLUETOOTH.1 22.91,22.81 v24.03,21.69 | v37.59,19.25 37.59,20.55 U6.5 | v37.64,43.69 37.64,43.63 U8.14 37.64,40.44 v38.46,39.62 v30.94,39.62 | 50.44,42.72 50.44,43.03 49.78,43.69 v46.18,43.69 | v12.8,27.33 13.06,27.53 14.33,28.8 v14.38,35.36
  Bottom 0.406: ULTRASONIC2.1 64.35,65.42 65.48,66.55 65.48,69.09 66.95,70.56 67.4,70.56 AN1.2 | 60.02,65.42 BLUETOOTH1.1
  Bottom 0.813: 81.67,41.69 ULTRASONIC1.1 64.45,41.69 62.48,39.73 | 62.59,37.7 62.59,39.62
  Bottom 1.016: v36.93,60.5 58.78,60.5 | 58.78,60.5 59.08,60.81 59.08,65.39 BLUETOOTH1.1 59.05,65.42 ULTRASONIC2.1 | 58.78,60.5 85,60.5 JP3.2 91.89,62 92.66,61.18 5V_CONTROL.1
+5V_SERVO  (via drill 0.3 pad 0.61)
  Top 0.203: v83.11,56.62 83.11,66.04 83.87,66.8 83.87,70.41 83.77,70.51
  Top 0.305: U2.8 U2.9 49.07,65.49
  Top 0.406: 49.37,65.49 49.07,65.49
  Top 0.762: C3.1 52.07,68.09 49.57,65.59 49.37,65.49
  Top 1.016: v85.04,75.29 85.04,71.37 84.89,71.22 84.8,71.19 84.12,70.51 83.77,70.51 81.01,70.51 D4.2 D5~.2 D13~.2 | C3.1 53.47,74.7 53.49,74.73 v53.49,74.93
  Bottom 0.203: 5V_SERVO.1 92.81,54.91 91.14,56.59 83.21,56.59 v83.11,56.62
  Bottom 1.016: v85.04,75.29 83.77,76.56 83.77,76.61 83.72,76.66 54.2,76.61 53.49,75.89 v53.49,74.93
A0
  Bottom 0.203: 87.97,36.61 FRONT_IR_SENSOR.1 87.99,36.6 87.99,34.98 84.56,31.55 38.16,31.55 34.59,35.11 JP2.14
A1
  Bottom 0.203: 87.97,39.1 FRONT_IR_SENSOR.2 87.97,39.12 87.17,39.12 85.7,37.64 85.7,33.86 83.79,31.95 38.78,31.95 37.19,33.55 37.19,37.6 JP2.13
A2
  Bottom 0.203: FRONT_IR_SENSOR.3 86.6,41.69 85.19,40.28 85.19,34.44 83.16,32.41 40.97,32.41 39.67,33.71 39.67,36.89 JP2.12
A3
  Bottom 0.203: FRONT_IR_SENSOR.6 86.24,49.31 86.06,49.12 86.06,41.96 84.63,40.54 84.63,35.05 83.26,33.68 42.93,33.68 42.22,34.49 42.22,36.07 JP2.11
A4
  Bottom 0.203: FRONT_IR_SENSOR.7 87.11,51.85 85.45,50.19 85.45,42.22 84.02,40.79 84.02,35.56 83.36,34.9 45.23,34.95 44.77,35.41 JP2.10
A5
  Bottom 0.203: FRONT_IR_SENSOR.8 87.26,54.39 84.94,52.07 84.94,42.42 83.41,40.89 83.41,35.99 82.98,35.56 47.73,35.56 47.3,36 47.3,37.19 JP2.9
ADC6_EXT  (via drill 0.3 pad 0.61)
  Top 0.203: v78.64,27.69 78.69,62.22 76.34,64.57 68.33,64.57 67.46,65.44 AN1.1 | U7.19 61.76,27.83 v61.77,27.69
  Bottom 0.203: v78.64,27.69 v61.77,27.69
ADC7_EXT  (via drill 0.3 pad 0.61)
  Top 0.203: U7.22 59.38,26.36 v59.38,26.92 | AN2.1 71.11,66.36 71.83,65.63 76.2,65.63 79.3,62.53 79.3,31.34 v79.3,26.92
  Bottom 0.203: v59.38,26.92 v79.3,26.92
AIN1  (via drill 0.3 pad 0.61)
  Top 0.203: v41.55,45.36 v43.94,45.36
  Bottom 0.203: U3.16 32.29,48.18 34.44,46.02 40.89,46.02 v41.55,45.36 | U8.8 45.26,44.24 | 45.26,44.24 45.26,44.25 | 45.26,44.24 45.26,44.5 44.4,45.36 v43.94,45.36
AIN2
  Bottom 0.203: U3.15 31.63,47.47 34.09,45.01 40.71,45.01 41.45,44.27 U8.11
AM1
  Top 1.016: L3.P$2 19.39,48.21 18.49,47.31 TERMINAL_A.1
BIN1  (via drill 0.3 pad 0.61)
  Top 0.203: v36.73,49.17 39.37,49.17 v40.13,49.94
  Bottom 0.203: v40.13,49.94 40.13,49.33 40.28,48.37 U8.3 | U3.9 27.79,48.39 27.79,50.29 28.25,50.75 29.77,50.75 30.53,49.99 36,49.98 36.73,49.25 v36.73,49.17
BIN2  (via drill 0.3 pad 0.61)
  Top 0.203: v36.37,46.63 v43.94,46.63
  Bottom 0.203: v36.37,46.63 36.37,48.44 35.23,49.58 30.33,49.58 29.67,50.24 28.76,50.24 28.4,49.88 28.4,48.34 U3.10 | 43.89,48.52 U8.6 43.94,48.32 v43.94,46.63
BM1
  Top 1.016: L4.P$2 19.84,40.04 TERMINAL_B.1
BUTTON/D16/328  (via drill 0.3 pad 0.61)
  Top 0.203: JP1.1 69.68,52.65 70.36,51.97 v70.36,29.77 | v55.02,29.72 55.02,22.97 55.23,22.76 U7.26 | R2.2 11.44,35.41 9.55,35.41 9.27,35.13 SW1.P$1 SW1.P$4 18.19,32.61 18.44,32.36 v18.44,28.96
  Bottom 0.203: v18.44,28.96 18.54,28.85 39.73,28.85 40.59,29.72 v55.02,29.72 55.07,29.77 v70.36,29.77
BUZZER_328  (via drill 0.3 pad 0.61)
  Top 0.203: U7.13 63.43,21.16 v63.35,21.23
  Bottom 0.203: v63.35,21.23 62.99,20.88 54.56,20.88 53.8,21.64 49.84,21.64 49.02,20.83 40.59,20.83 39.73,21.69 37.44,21.69 37.39,21.74 37.39,22.64 U6.1
C14
  Top 0.203: U7.8 66.39,16.51 66.8,16.92 66.8,18.95 67.72,19.86 67.72,21.94 68.89,23.11 70.92,23.11 71.17,23.37 71.17,24.56 C13.2 71.16,26.3 71.73,26.87 72.77,26.87 72.8,26.91 Y1.1
D0/RX  (via drill 0.3 pad 0.61)
  Top 0.203: JP1.4 60,48.77 58.52,47.3 58.52,40.52 58.18,40.18 56.61,40.18 56.08,39.66 v56.08,27.23 | v40.74,17.78 v40.74,27.23
  Bottom 0.203: BLUETOOTH.3 40.54,17.73 40.69,17.88 40.69,17.93 v40.74,17.78 | v56.08,27.23 v40.74,27.23
D1/TX  (via drill 0.3 pad 0.61)
  Top 0.203: JP1.3 62.54,50.6 59.08,47.14 59.08,39.67 58.78,39.37 58.78,36.47 56.69,34.39 v56.69,26.62 | v41.55,26.62 v41.55,17.12
  Bottom 0.203: v41.55,17.12 20.18,17.12 20.17,17.07 18.29,15.19 BLUETOOTH.4 | v41.55,26.62 41.67,26.62 41.79,26.74 55.27,26.74 55.4,26.62 v56.69,26.62
D2
  Top 0.203: D2.C 49,6.17 48.56,6.6 47.3,6.6 R18.1
D4/CAÑON  (via drill 0.3 pad 0.61)
  Top 0.203: v81.94,55.37 81.94,67.88 D4.1
  Bottom 0.203: JP1.9 47.3,54.63 47.99,55.32 82.09,55.32 v81.94,55.37
D5/SERVO2  (via drill 0.3 pad 0.61)
  Top 0.203: v81.03,56.19 81.03,64.26 78.94,66.34 78.33,66.95 78.33,67.94 D5~.1
  Bottom 0.203: JP1.10 44.76,55.09 45.85,56.19 v81.03,56.19
D6/AIN2  (via drill 0.3 pad 0.61)
  Top 0.203: v40.18,44.35 44.5,44.35 44.86,44.7 44.86,50.34 44.55,50.65 42.47,50.65 42.22,50.9 JP1.11
  Bottom 0.203: U8.12 40.18,43.84 v40.18,44.35
D7/ECHO_ARDUINO  (via drill 0.3 pad 0.61)
  Top 0.203: v76.2,56.84 76.2,47.45 75.39,46.63 | 74,46.75 ULTRASONIC1.3 75.25,46.77 75.39,46.63 | 75.39,46.63 75.69,46.63 76.05,46.28 v76.05,29.92
  Bottom 0.203: 87.16,31.09 JP4.1 87.21,31.14 85.04,31.14 83.82,29.92 v76.05,29.92 | JP1.12 39.68,55.9 40.62,56.84 v76.2,56.84
D8/TRIGGER_ARDUINO  (via drill 0.3 pad 0.61)
  Top 0.203: ULTRASONIC1.2 72.66,44.23 72.19,44.7 72.19,53.09 73.25,54.15 v73.25,57.96 | v84.28,58.01 84.28,63.25 JP3.1
  Bottom 0.203: JP1.13 37.14,56.49 38.61,57.96 v73.25,57.96 84.23,57.96 v84.28,58.01
D9/AIN1  (via drill 0.3 pad 0.61)
  Top 0.203: JP1.14 34.6,45.77 36.68,43.69 36.68,41 37.29,40.39 43.89,40.39 v43.99,40.28
  Bottom 0.203: v43.99,40.28 43.99,42.37 U8.9
D10/BIN2
  Bottom 0.203: JP1.15 32.06,51.2 32.51,50.8 40.61,50.8 41.45,49.96 41.45,48.63 U8.4
D11/BIN1
  Bottom 0.203: U8.1 37.64,49.66 36.91,50.39 30.79,50.39 29.52,51.66 JP1.16
D12/BUZZER_ARDUINO  (via drill 0.3 pad 0.61)
  Top 0.203: R16.1 34.23,34.65 | JP1.17 26.98,52.42 28.85,50.55 31.39,50.55 33.27,48.67 33.27,46.43 36.02,43.69 36.02,36.47 34.85,35.31 34.75,35.31 R16.1 | v38.1,23.77 38.1,29.92 34.24,33.78 R16.1
  Bottom 0.203: 38.15,22.74 U6.2 38.1,22.69 v38.1,23.77
D13/SERVO1  (via drill 0.3 pad 0.61)
  Top 0.203: v79.91,30.94 79.91,62.66 D13~.1 | JP2.17 v26.98,31.7
  Bottom 0.203: v79.91,30.94 78.64,30.94 78.54,31.04 37.74,31.04 37.08,31.7 v26.98,31.7
D14/MISO_MICRO  (via drill 0.3 pad 0.61)
  Top 0.203: JP2.2 65.08,47.85 63.96,48.97 63.96,58.98 62.43,60.5 56.7,60.5 55.37,61.83 55.37,76.2 v51.82,79.76
  Bottom 0.203: JP2.2 65.08,38.45 | IR_REC1.3 47.88,80.33 48.46,79.76 v51.82,79.76
D15/SCK_MICRO  (via drill 0.3 pad 0.61)
  Top 0.203: v51.56,34.29 51.56,14.22 50.39,13.06 v50.39,8.43 | v67.61,34.29 67.62,34.6 JP2.1
  Bottom 0.203: v51.56,34.29 v67.61,34.29 | IR_REC2.3 46.62,4.9 47.35,4.17 49.62,4.17 50.34,4.88 50.34,8.38 v50.39,8.43
DEBIL_1  (via drill 0.3 pad 0.61)
  Top 0.203: 58.73,24.99 U7.23 v58.56,33.06 v58.57,33.07 | v80.52,33.07 80.52,45.87 80.82,46.18 81.81,46.18 IR_REC3.3
  Bottom 0.203: 80.67,33.17 v80.52,33.07 v58.57,33.07
DEBIL_2  (via drill 0.3 pad 0.61)
  Top 0.203: IR_REC4.3 14.62,44.87 15.34,44.15 15.34,37.8 v15.24,37.69 | U7.24 57.78,27.36 v57.76,27.33
  Bottom 0.203: v57.76,27.33 57.3,27.84 39.83,27.84 39.47,27.48 16.51,27.48 15.24,28.75 v15.24,37.69
ECHO_328  (via drill 0.3 pad 0.61)
  Top 0.203: ULTRASONIC2.3 63.5,70.41 65.43,68.48 65.43,66.8 66.5,65.73 v66.5,65.02 | v66.5,62.89 76,62.89 77.37,61.52 77.37,26.52 78.18,25.7 79.35,25.7 v80.01,25.04 | U7.11 66.46,19.56 67.26,20.35 v67.26,25.04
  Bottom 0.203: v66.5,65.02 v66.5,62.89 | v67.26,25.04 v80.01,25.04
GND  (via drill 0.3 pad 0.3, 0.3 pad 0.61, 0.61 pad 0.81, 0.8, 0.8 pad 1.4)
  Top 0.203: v49.15,8.43 R18.2 | 48.21,15.29 47.57,15.93 47.57,16.96 U5.9 | U5.11 48.59,15.67 48.21,15.29 | 48.21,15.29 v48.23,15.29 | v48.23,15.29 48.23,15.24 50.25,15.24 50.9,15.89 v50.9,19.05 50.9,19.86 50.56,20.2 U5.18 49.81,21.92 50.39,22.5 v50.39,22.76 | C15.1 26.27,45.92 | v49.17,82.09 49.13,82.05 R17.2 45.37,82.05 v45.36,82.04 | R18.2 45.4,8.45 v45.36,8.48 | 53.49,61.87 C3.2 | 59.38,16.5 U7.3 59.38,15.35 v59.38,15.34 60.81,15.34 60.98,15.51 U7.5 60.98,17.7 v60.96,17.7 | v84.73,20.93 JP4.3 | JP4.3 89.35,26.8 R10.1 | v60.15,20.07 60.15,24.98 U7.21 60.16,26.04 v60.15,26.11 | v81.84,49.33 81.84,47.42 IR_REC3.4 | C21.2 68.02,44.09 68.02,45.67 C20.2 v67.92,49.28 v67.91,49.28 v67.92,49.28 | v55.58,48.31 55.58,46.53 U9.1 55.6,46.43 57.53,46.43 58.01,45.95 58.01,41.25 57.81,41.05 v57.81,41 57.96,40.95 | v48.21,22.76 48.21,23.72 47.24,24.69 U4.2 45.85,24.69 44.45,24.69 42.98,26.16 42.98,27.89 41.98,28.89 C18.2 | BLUETOOTH.2 17.12,20.27 | 17.12,20.27 15.44,18.59 15.44,16.1 14.78,15.44 12.79,15.44 ICSP.6 | SW1.P$2 15.27,28.62 15.39,28.5 15.95,28.5 | 15.95,28.5 SW1.P$3 | R8.1 4.95,27.3 | GND.1 4.95,27.36 4.95,27.3 | BACK_IR_SENSOR.2 7.13,43.59 IR_REC4.4 12.69,43.64 v14.48,43.64 | R9.1 8.12,64 v8.08,63.96 | JP4.3 84.71,26.8 | IR_REC4.1 v14.52,47.41 v14.53,47.4 | 17.12,20.27 16.51,20.27 15.95,20.83 15.95,28.5 | 15.95,28.5 SW1.P$3 | C11.2 28.7,32.81 v28.7,32.61 v28.7,30.28 | R16.2 32.36,34.76 v32.36,32.61 v32.36,23.42 | SW1.P$2 11.35,28.62 | v16.46,30.28 16.46,29.01 SW1.P$3 | JP2.4 v60,40.99 v59.99,41 | v9.25,31.04 9.25,28.65 SW1.P$2 | 4.95,27.3 4.83,27.18 | IR_REC3.1 83.61,43.59 v83.62,43.59 | 78.19,24.13 78.38,24.18 78.48,24.19 C12.1 78.81,24.16 82.09,24.16 JP4.3
  Top 0.203: C13.1 69.16,26.09 v69.14,26.11 | v48.23,15.29 48.23,11.86 47.3,10.92 47.3,8.49 R18.2
  Top 0.305: 46.46,64.48 U2.4 45.49,64.49 44.77,64.49 | 46.46,64.48 U2.11 47.48,64.48 U2.7 49.17,64.49 | 24.82,64.43 U1.4 26.41,64.42 arc90 U1.11 arc90 27.43,64.42 U1.7 29.02,64.43 | C5.2 25.92,62.13 26.42,62.63 26.42,64.41 | C2.2 45.97,62.09 46.47,62.59 46.47,64.47 46.46,64.48 | 20.42,61.11 20.42,62.38 | 20.42,62.38 20.47,62.43 | C4.2 20.42,62.38 | 20.42,62.38 | 20.42,62.38 20.42,63.3 20.47,63.35
  Top 0.406: 44.47,64.49 44.77,64.49 | 49.27,64.49 49.17,64.49 | 24.52,64.43 24.82,64.43 | 29.32,64.43 29.02,64.43 | 26.42,64.41 26.41,64.42 | FRONT_IR_SENSOR.5 87.09,46.77 86.41,47.45 v83.57,47.45 81.89,47.45 IR_REC3.4 | v26.26,45.26 C15.1
  Top 0.61: 44.37,64.49 44.47,64.49 | 49.57,64.49 49.27,64.49 | 24.22,64.43 24.52,64.43 | 29.62,64.43 29.32,64.43 | 89.56,63.99 88.77,63.99 85.09,67.67 v85.09,69.19
  Top 0.813: 44.07,64.49 44.37,64.49 | 49.87,64.49 49.57,64.49 | 23.82,64.43 24.22,64.43 | 29.92,64.43 29.62,64.43
  Top 1.016: C4.2 21.22,61.83 23.82,64.43 | C6.2 32.52,61.83 29.92,64.43 | C1.2 41.47,61.89 44.07,64.49 | C3.2 52.47,61.89 49.87,64.49 | R11.1 89.56,63.99 89.56,61.42 87.94,59.8 JP3.3 89.4,59.8 91.29,57.91 91.29,48.77 89.2,46.69 88.08,46.69 FRONT_IR_SENSOR.5 | 53.49,61.87 53.49,58.27 54.97,56.79 54.97,52.7 JP1.6
  Top 2.032: JP8.2 19.95,57.36 JP5.2 19.91,57.86 20.42,58.37 20.42,61.11
  Bottom 0.203: 70.58,21.59 R3.1 74.04,20.93 | IR_REC2.1 v49.15,8.43 | C19.2 47.1,19.05 46.53,19.05 44.66,17.18 C10.2 44.38,16.33 45.36,15.29 v48.23,15.29 59.33,15.29 v59.38,15.34 | v50.9,19.05 49.79,19.05 C9.2 | 47.1,22.26 C8.2 | U3.17 30,46.46 30.33,46.79 U3.13 | 30.19,45.31 30.36,45.14 | v49.17,82.09 49.17,84.83 IR_REC1.4 | IR_REC1.1 45.36,84.83 v45.36,82.04 45.36,75.03 47.14,73.25 55.49,73.25 55.5,73.26 55.48,73.26 55.42,73.2 | v45.36,8.48 45.36,6.17 IR_REC2.4 | R4.1 76.8,20.96 R5.1 R6.1 R7.1 v84.73,20.93 | v81.84,49.33 81.82,49.31 ULTRASONIC1.4 67.83,49.31 v67.92,49.28 | U8.7 55.53,48.27 v55.58,48.31 | 55.57,48.32 v55.58,48.31 | C8.2 47.77,22.32 v48.21,22.76 v50.39,22.76 | 35.1,21.88 Q1.2 | v60.15,26.11 v69.14,26.11 84.04,26.11 JP4.3 | v8.08,63.96 8.18,63.91 10.26,61.82 18.69,61.82 19.81,60.71 19.81,57.5 JP5.2 | JP8.2 20.02,53.65 20.02,50.39 17.02,47.4 v14.53,47.4 14.53,43.69 v14.48,43.64 13.66,42.82 13.66,31.86 12.79,30.99 9.35,30.99 v9.25,31.04 8.13,32.16 3.3,32.16 1.88,30.73 1.58,30.73 GND.1 | v28.7,32.61 v32.36,32.61 | v28.7,30.28 v16.46,30.28 | v57.81,41 v59.99,41 | v83.62,43.59 83.62,47.4 v83.57,47.45 | C8.2 47.02,22.31 C7.2 44.25,22.3 39.09,22.3 U6.3 38.76,22.69 38.76,24.33 38.51,24.59 37.64,24.59 36.93,23.88 35.36,23.88 35.1,23.62 35.1,22.38 Q1.2 | v60.15,20.07 60.25,20.12 60.96,19.41 v60.96,17.7 | v32.36,23.42 34.29,23.42 34.8,22.91 34.8,22.07 Q1.2 | v55.58,48.31 55.58,49.73 54.92,50.39 JP1.6
  Bottom 0.406: U3.6 29.04,43.41 29.06,43.43 29.06,44.6 29.11,44.65 29.15,44.65 U3.17 | U3.3 30.96,44.53 30.36,45.14 U3.17 | v14.48,43.64 14.58,43.64 15.6,44.65 25.67,44.65 26.26,45.25 v26.26,45.26 29.76,45.26 U3.17
  Bottom 0.762: 74.04,20.93 R4.1
  Bottom 1.016: JP8.2 20.79,53.71 32,64.92 46.94,65.02 | 46.94,65.02 U2.11 | 46.94,65.02 52.32,65.02 55.42,68.12 | 63.3,73.24 ULTRASONIC2.4 | ULTRASONIC2.4 AN1.3 AN2.3 D13~.3 D5~.3 D4.3 84.29,73.04 85.09,72.24 v85.09,69.19 | 88.02,46.79 FRONT_IR_SENSOR.5 | 55.42,68.12 58.89,68.12 BLUETOOTH1.2 | 55.42,68.12 55.42,73.2 55.42,74.4 56.31,75.29 62.3,75.29 63.09,74.49 ULTRASONIC2.4
  other vias: 30,45.5 26.92,64.93 46.97,64.99
ILUM_1
  Top 0.203: LED7.A 4.83,66.22 4.83,67.11 4.42,67.51 1.68,67.51 0.86,66.7 0.86,64.36 3.25,61.98 3.25,34.56 5.94,31.87 5.94,25.15 5.8,25 LED6.A
ILUM_2  (via drill 0.3 pad 0.61)
  Top 0.203: U7.25 58.04,23.54 v58.06,23.52 | LED9.A 89.5,67.1 90.32,67.92 93,67.92 93.78,67.15 93.78,43.69 90.88,40.59 90.88,28.91 91.44,28.35 92.56,28.35 92.96,27.94 92.96,23.99 92.4,23.42 89.97,23.42 89.46,23.93 89.46,25.45 LED8.A 87.43,25.46 v87.38,25.4
  Bottom 0.203: v58.06,23.52 85.45,23.47 v87.38,25.4
LED4  (via drill 0.3 pad 0.61)
  Top 0.203: LED4.C 79.62,16.35 v79.67,16.31
  Bottom 0.203: v79.67,16.31 79.67,18.99 R6.2
MISO/IR_REAR_LEFT  (via drill 0.3 pad 0.61)
  Top 0.203: 6.38,49.43 BACK_IR_SENSOR.4 | v64.82,24.49 64.82,23.55 U7.16 | v7.01,36.88 7.01,25.37 10.23,22.15 ICSP.1
  Bottom 0.203: v64.82,24.49 57.61,24.49 56.64,25.35 37.34,25.35 36.42,24.43 11.11,24.43 10.23,23.56 ICSP.1 | BACK_IR_SENSOR.4 4.55,49.31 3.86,48.62 3.86,38.28 5.21,36.93 6.96,36.93 v7.01,36.88
MOSI/ENABLE  (via drill 0.3 pad 0.61)
  Top 0.203: U7.15 65.68,22.76 65.94,23.02 v65.94,28.4 | v43.69,35.56 v43.69,28.45 | v34.44,40.28 33.38,39.22 v33.38,36.22 | v19.66,31.29 19.66,26.77 v18.69,25.81 | v15.14,25.76 14.58,25.2 v14.58,23.62
  Bottom 0.203: 42.67,41.05 42.47,40.74 39.37,40.74 38.86,41.35 U8.13 38.91,43.94 38.46,44.4 36.68,44.4 36.27,43.99 36.27,40.84 35.71,40.28 v34.44,40.28 | 42.67,41.05 42.67,42.42 U8.10 42.72,46.59 42.47,46.84 | U8.2 38.86,47.14 39.17,46.84 42.47,46.84 | 42.47,46.84 42.72,47.09 42.72,48.52 U8.5 | 42.67,41.05 42.67,39.83 43.59,38.91 43.59,35.66 v43.69,35.56 | v65.94,28.4 65.99,28.35 43.89,28.35 43.69,28.55 v43.69,28.45 | v33.38,36.22 33.38,35.31 32.51,34.44 22.81,34.44 v19.66,31.29 | v18.69,25.81 15.19,25.81 v15.14,25.76 | v14.58,23.62 12.65,23.62 11.48,22.45 11.48,18.75 12.23,18 ICSP.4
N$1  (via drill 0.3 pad 0.61)
  Top 0.305: 23.63,45.53 23.63,47.2 23.67,47.24 23.67,46.53 24.25,45.95
  Top 0.406: 24.25,45.95 28.6,41.6 30.89,41.6 v31.6,40.89
  Top 1.016: 21.28,45.26 21.23,45.21 C16.1 23.22,45.11 23.63,45.53 L3.P$1 23.62,48.81
  Bottom 0.406: v31.6,40.89 31.6,42.65 U3.2
N$2  (via drill 0.3 pad 0.61)
  Top 0.406: v30.33,40.79 27.69,40.79 27.69,40.84 25.35,43.18 21.36,43.18 C16.2
  Top 1.016: TERMINAL_A.2 18.57,42.7 19.05,43.18 21.32,43.18 C16.2
  Bottom 0.305: v30.33,40.79 U3.4
N$3  (via drill 0.3 pad 0.61)
  Top 0.406: L4.P$1 23.76,40.55 v26.82,40.54
  Top 0.813: 23.6,40.03 L4.P$1
  Top 1.016: L4.P$1 23.7,37.97 22.25,36.52 C17.1
  Bottom 0.406: v26.82,40.54 27.69,40.54 28.35,41.3 28.35,42.65 U3.7
N$4  (via drill 0.3 pad 0.61)
  Top 0.406: C17.2 22.99,34.62 25.5,37.13 25.5,39.32 26.01,39.83 v29.67,39.83
  Top 1.016: C17.2 19.08,34.62 TERMINAL_B.2
  Bottom 0.305: v29.67,39.83 29.67,42.58 U3.5
N$5  (via drill 0.3 pad 0.61)
  Top 0.203: 49.79,17.68 U5.13 49.78,17.73 49.07,17.73 48.87,17.93 48.87,18.44 48.67,18.64 47.35,18.64 47.09,18.38 U5.8 47.09,16.15 46.89,15.95 v46.53,15.95
  Bottom 0.203: v46.53,15.95 46.53,16.26 C19.1
N$6
  Top 2.032: 17.32,57.45 JP5.1 | JP5.1 17.38,53.75 JP8.1 | F1.1 17.33,57.35 JP5.1
N$7  (via drill 0.3 pad 0.61)
  Top 0.203: R1.1 34.01,41.63 v33.02,42.62
  Bottom 0.203: v33.02,42.62 32.34,42.62 U3.1
N$9  (via drill 0.3 pad 0.61)
  Top 0.203: v27.79,46.79 27.79,44.2 29.52,42.47 31.9,42.47 32.87,41.5 v32.87,40.49
  Bottom 0.203: U3.11 29.04,47.36 28.82,47.14 28.11,47.14 27.79,46.82 v27.79,46.79 | v32.87,40.49 32.87,41.22 33.23,41.59 C14.2
N$10
  Top 0.305: U1.1 25.45,72.11
  Top 0.406: 25.45,72.11 L2.2
N$11
  Top 0.305: C2.1 arc90 48.44,60.96 U2.6
N$12
  Top 0.305: U1.10 28.4,68.38 32.61,72.59 L2.1
N$13
  Bottom 0.203: R13.2 31.6,19.15 32.41,18.34 38.25,18.34 38.76,18.85 38.76,20.09 U6.4
N$14
  Bottom 0.203: R13.1 29.7,20.86 30.43,21.54 33.34,21.54 Q1.1
N$15
  Top 0.305: L1.2 43.97,69.03 45.47,67.79 45.47,66.01 U2.1
N$16
  Top 0.305: L1.1 50.83,71.15 48.37,67.79 48.37,66.05 U2.10
N$17  (via drill 0.3 pad 0.61)
  Top 0.203: v35.1,19.81 36.25,19.81 BUZZ1.-
  Bottom 0.203: Q1.3 35.06,19.86 v35.1,19.81
N$18
  Top 0.305: U1.6 28.4,60.9
  Top 0.406: 28.4,60.9 C5.1
N$19  (via drill 0.3 pad 0.61)
  Top 0.203: v71.27,16.31 71.27,18.91 LED1.C
  Bottom 0.203: R3.2 71.24,16.34 v71.27,16.31
N$20  (via drill 0.3 pad 0.61)
  Top 0.203: LED2.C 74.03,16.34 v74.07,16.31
  Bottom 0.203: v74.07,16.31 R4.2
N$21  (via drill 0.3 pad 0.61)
  Top 0.203: LED3.C 76.83,16.35 v76.87,16.31
  Bottom 0.203: v76.87,16.31 76.87,19 R5.2
N$22
  Top 0.203: LED8.C 91.55,26.9 R10.2
N$23
  Top 0.203: D1.C 45.5,84.45 46.02,83.92 47.22,83.92 R17.1
N$24  (via drill 0.3 pad 0.61)
  Top 0.203: LED5.C 82.41,16.46 v82.47,16.41
  Bottom 0.203: v82.47,16.41 82.47,18.98 R7.2
N$27  (via drill 0.3 pad 0.61)
  Top 0.203: 26.47,47.95 26.27,48.15 C15.2 26.66,47.95 31.14,47.95 31.9,47.19 v31.9,45.87
  Bottom 0.203: v31.9,45.87 31.9,46.63 31.45,47.09 31.24,47.09 30.99,47.35 30.99,48.3 U3.14
N$28
  Top 0.203: U7.7 62.58,15.5 62.94,15.14 66.83,15.14 67.41,15.72 67.41,18.59 68.17,19.36 68.17,21.49 69.24,22.55 74.14,22.55 74.19,22.55 74.4,22.76 Y1.2 74.55,24.08 75.95,24.08 76.3,24.43 76.42,24.43 C12.2
N$31  (via drill 0.3 pad 0.61)
  Top 0.203: U9.6 60.88,44.04 v62.38,44.04 | v65.99,47.19 65.99,45.85 C20.1 | v57.3,45.11 56.39,45.11 56.24,45.26 55.63,45.26 U9.2 55.58,45.21 v54.1,45.21 | v52.68,45.21 52.68,46.33 52.53,46.48 51.75,46.48 R21.3
  Bottom 0.203: v65.99,47.19 65.99,44.35 65.68,44.04 v62.38,44.04 58.37,44.04 v57.3,45.11 | v54.1,45.21 v52.68,45.21
N$32
  Top 0.406: LED6.C 3.05,25 R8.2
N$33
  Top 0.203: LED7.C 2.95,64.1 R9.2
N$34
  Top 0.203: R11.2 91.6,64 LED9.C
N$35  (via drill 0.3 pad 0.61)
  Top 0.203: v48.56,20.02 48.56,20.9 U5.20
  Bottom 0.203: C10.1 44.38,19.34 44.35,19.25 45.11,20.02 v48.56,20.02
N$36  (via drill 0.3 pad 0.61)
  Top 0.203: v48.11,17.88 48.11,17 U5.10
  Bottom 0.203: C9.1 49.59,17.16 48.87,17.88 v48.11,17.88
N$39  (via drill 0.3 pad 0.61)
  Top 0.203: U9.7 62.35,45.23 v62.38,45.26 | R21.2 49.17,44.96 50.21,43.92 R20.3 52.6,43.92 v52.63,43.89
  Bottom 0.203: v62.38,45.26 58.37,45.26 57.71,45.92 57,45.92 54.97,43.89 v52.63,43.89
N$41
  Top 2.032: SW2.COM 13.06,70.1 16.92,66.24 16.92,63.04 14.43,60.55 F1.2
N$42  (via drill 0.3 pad 0.61)
  Top 0.203: U9.5 62.36,42.7 v62.38,42.67 | C21.1 66.01,42.75 v66.02,42.67
  Bottom 0.203: v62.38,42.67 v66.02,42.67 66.04,42.57
OUTPUT_555
  Top 0.203: D1.A 50.26,87 50.85,86.41 50.85,79.15 54.76,75.23 | U9.3 53.49,43.97 | 53.49,43.97 53.49,47.98 56.2,50.69 56.2,58.51 54.76,59.95 54.76,75.23 | 53.49,43.97 53.49,42.47 51.16,40.13 51.16,36.02 52.17,35 52.17,14.07 51.1,13.01 51.1,3.56 49.78,2.23 47.19,2.23 45.5,3.93 D2.A | 54.76,75.18 54.76,75.23
RESET  (via drill 0.3 pad 0.61)
  Top 0.203: R12.1 38.42,33.51 39.06,32.87 v39.06,29.46 | v20.68,29.46 20.68,14.33 20.37,14.02 11.67,14.02 ICSP.5 | v56.79,13.92 56.79,17.02 58.22,18.44 58.22,19.61 57.51,20.32 56.35,20.32 U7.29
  Bottom 0.203: v39.06,29.46 v20.68,29.46 20.68,29.52 | 10.23,15.42 ICSP.5 10.24,15.46 11.68,14.02 20.28,14.02 20.57,14.32 20.57,16 21.19,16.61 24.83,16.61 25.4,16.04 25.4,14.44 25.92,13.92 v56.79,13.92
RX328  (via drill 0.3 pad 0.61)
  Top 0.203: v71.78,29.06 71.78,60.9 70.71,61.98 61.62,61.98 61.16,62.43 61.16,69.44 60.1,70.51 59.54,70.51 BLUETOOTH1.3 | v53.54,29.06 53.54,19.81 53.8,19.56 U7.30
  Bottom 0.203: 53.49,29.16 v53.54,29.06 v71.78,29.06
SCK/IR_REAR_RIGHT  (via drill 0.3 pad 0.61)
  Top 0.203: BACK_IR_SENSOR.1 6.4,41.59 6.4,24.13 9.04,21.49 9.04,18.03 9.08,18 ICSP.3 11.53,19.3 v14.53,19.3 | U7.17 63.36,22.27 v63.35,22.25 | v59.08,21.64 v59.08,18.75 | v53.9,17.32 v53.9,14.58 | v27.38,16.51 24.89,19 v23.47,19
  Bottom 0.203: v63.35,22.25 62.94,21.84 59.28,21.84 v59.08,21.64 | v59.08,18.75 58.27,17.93 54.51,17.93 v53.9,17.32 | v53.9,14.58 29.31,14.58 v27.38,16.51 | v23.47,19 14.83,19 v14.53,19.3
SCL_3.3
  Top 0.203: U5.23 47.09,21.48 47.5,21.89 49.12,21.89 49.51,22.28 U4.5
SCL_5  (via drill 0.3 pad 0.61)
  Top 0.203: JP1.8 49.84,48.62 48.11,46.89 48.11,40.54 48.56,40.08 v48.56,29.11 48.56,27.28 49.33,26.52 49.33,25.5 U4.8 49.58,25.25 50.24,25.25 v50.78,24.7 50.8,24.69 | U7.28 56.45,21.03 57.45,21.03 v57.96,21.54 | v39.22,26.77 39.22,28.19 v39.17,28.25 | v5.13,31.09 2.44,33.78 2.44,46.08 1.98,46.53 1.36,46.53 SCL.1
  Bottom 0.203: v5.13,31.09 5.28,30.99 10.26,26.62 39.06,26.62 v39.22,26.77 | v57.96,21.54 57.1,21.54 56.29,22.35 56.29,24.13 55.71,24.7 v50.78,24.7 | v39.17,28.25 41.05,28.25 41.81,29.06 48.51,29.06 v48.56,29.11
SDA_3.3
  Top 0.203: U5.24 46.59,21.94 45.87,22.66 45.87,23.37 U4.4
SDA_5  (via drill 0.3 pad 0.61)
  Top 0.203: v45.97,26.01 45.97,39.78 47.6,41.4 v47.6,49.33 | U7.27 55.06,21.94 54.97,21.95 54.66,21.95 54.36,22.25 v54.36,26.01 | v45.97,26.01 45.97,25.33 U4.1 45.97,25.43 v45.97,26.01 | v35.61,25.04 35.61,30.28 v35.56,30.33 | v45.97,26.01 45.97,30.28 v45.92,30.33 | 4.72,30.18 v4.67,30.23 1.38,33.52 1.38,43.63 SDA.1
  Bottom 0.203: v47.6,49.33 51.97,49.33 52.38,49.73 JP1.7 | v54.36,26.01 v45.97,26.01 | v4.67,30.23 4.72,30.23 10.67,24.99 v35.61,25.04 | v35.56,30.33 v45.92,30.33 45.97,30.28
TRIGGER_328  (via drill 0.3 pad 0.61)
  Top 0.203: U7.12 66.18,20.34 66.6,20.76 v66.6,24.28 | ULTRASONIC2.2 63.65,67.4 63.66,67.4 65.28,65.79 65.28,64.57 66.19,63.65 76.3,63.65 78.03,61.92 78.03,27.08 78.94,26.16 80.72,26.16 81.13,25.76 v81.13,25.04
  Bottom 0.203: v66.6,24.28 80.77,24.23 81.13,24.59 v81.13,25.04
TX328/ENABLE555  (via drill 0.3 pad 0.61)
  Top 0.203: U7.31 53.37,18.74 52.88,19.23 v52.88,30.43 52.88,33.33 53.65,34.09 53.65,41.66 54.66,42.67 55.58,42.67 U9.4 | 59.89,72.95 BLUETOOTH1.4 57.91,73.05 56.74,71.88 56.74,62.46 57.79,61.42 70.46,61.42 71.07,60.81 71.07,30.48 v71.02,30.43
  Bottom 0.203: v52.88,30.43 v71.02,30.43
VBAT  (via drill 0.3 pad 0.61, 0.61 pad 0.81)  (1 unrouted)
  Top 0.203: U1.3 U1.2 | R1.2 33.02,43.48 32.51,43.99 v32.51,44.04 32.51,48.56 31.69,49.38 v29.67,49.38
  Top 0.305: 24.72,65.43 25.44,65.43 U1.2 | U2.3 U2.2 44.87,65.49
  Top 0.406: 24.42,65.43 24.72,65.43 | 44.67,65.49 44.87,65.49
  Top 0.61: 24.02,65.63 24.22,65.63 24.42,65.43 | 44.47,65.49 44.67,65.49 | 19.86,69.14 19.86,68.59 C4.1
  Top 0.762: C1.1 41.67,68.09 44.17,65.59 44.47,65.49
  Top 0.813: SW2.2 12.22,74.7 10.16,72.64 10.16,54.2 12.75,51.61 12.9,51.36 24.89,51.36 26.01,50.24 27.74,50.24 27.74,50.19 28.55,49.38 v29.67,49.38
  Top 1.016: C4.1 21.62,68.03 24.02,65.63 | v40.49,72.68 40.49,68.11 C1.1
  Top 2.032: SW2.2 14.3,74.7 19.86,69.14
  Bottom 0.203: U3.12 29.67,48.82 v29.67,49.38 | 33.02,43.48 33.83,43.48 33.83,43.94 33.73,44.04 v32.51,44.04
  Bottom 1.016: SW2.2 14.9,72.7 40.47,72.7 v40.49,72.68
VIDA_1  (via drill 0.3 pad 0.61)
  Top 0.203: LED1.A 70.13,21.03 69.28,20.18 69.28,16.48 v69.29,16.41 | 56.24,17.86 U7.32 56.3,17.93 55.37,17.93 54.81,17.37 v54.81,16.41
  Bottom 0.203: v69.29,16.41 v54.81,16.41
VIDA_2  (via drill 0.3 pad 0.61)
  Top 0.203: U7.1 57.78,14.29 58.2,13.87 v72.69,13.87 | LED2.A 72.9,21.04 72.69,20.83 v72.69,15.29
  Bottom 0.203: v72.69,15.29 v72.69,13.87
VIDA_3
  Top 0.203: U7.2 58.56,14.79 58.83,14.53 74.73,14.53 75.49,15.29 75.49,20.68 75.84,21.03 LED3.A
VIDA_4  (via drill 0.3 pad 0.61)
  Top 0.203: LED4.A 79.62,21.78 79.3,22.1 69.76,22.1 68.58,20.91 v68.58,17.93 | 64.83,17.93 U7.9 65.97,17.96 v66.04,17.93
  Bottom 0.203: v66.04,17.93 v68.58,17.93
VIDA_5  (via drill 0.3 pad 0.61)
  Top 0.203: U7.10 64.86,18.8 v65.99,18.8 | LED5.A 82.41,22.67 v82.4,22.71
  Bottom 0.203: v65.99,18.8 68.02,18.8 68.48,19.25 68.48,21.63 69.5,22.66 v82.4,22.71

### Text on the board
bPlace: BD Robotics / Jaeger MKII 2015 / bilbaodynamics.com / Designed and assembled in BIZKAIA | VBAT | GND | C:/Users/JL/Desktop/2000px-WEEE_symbol_vectors.svg.bmp | 1 | 2 | 1 | 2
tNames: A | ON | _ | _ | + | E | S | T | D8 | + | _ | + | ULTRA | _ | WEAK 2 | E | WEAK 1 | REAR IR SENSOR | T | AN8 | + | ULTRASONIC1 | D7 | _ | + | MISO | +5 | Gnd | U5 | Tx | B | Rx